# EAGLE schematic untitled (EAGLE 9.6.2)
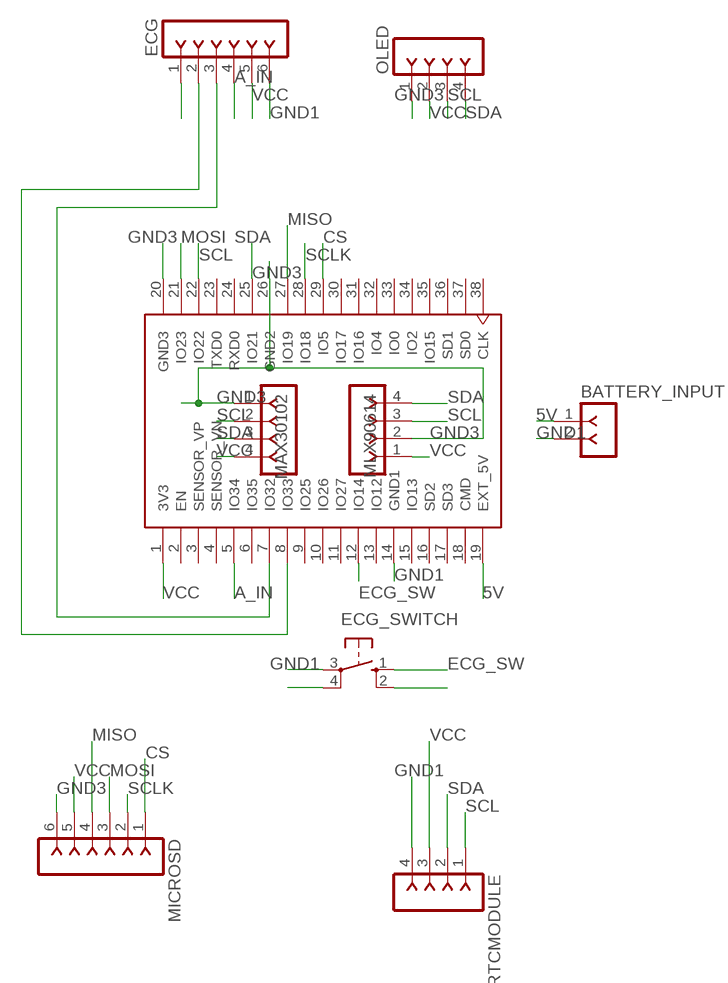
[diagram p0: schematic, sheet 1]

## Parts
BATTERY_INPUT  F-1X02-SIP-100-40  [SIP-100-02-40]
ECG  F-1X06-SIP-100-40  [SIP-100-06-40]
ECG_SWITCH  10-XX  [B3F-10XX]
MAX30102  F-1X04-SIP-100-40  [SIP-100-04-40]
MICROSD  F-1X06-SIP-100-40  [SIP-100-06-40]
MLX90614  F-1X04-SIP-100-40  [SIP-100-04-40]
OLED  F-1X04-SIP-100-40  [SIP-100-04-40]
RTCMODULE  F-1X04-SIP-100-40  [SIP-100-04-40]
U1  ESP32-DEVKITC-32D  [MODULE_ESP32-DEVKITC-32D]

## Nets
5V: BATTERY_INPUT.1 U1.19(EXT_5V)
A_IN: ECG.4 U1.5(IO34)
CS: MICROSD.1 U1.29(IO5)
ECG_SW: ECG_SWITCH.1(S) U1.12(IO14)
GND1: BATTERY_INPUT.2 ECG.6 ECG_SWITCH.3(P) RTCMODULE.4 U1.14(GND1)
GND3: MAX30102.1 MICROSD.6 MLX90614.2 OLED.1 U1.20(GND3) U1.26(GND2)
MISO: MICROSD.4 U1.27(IO19)
MOSI: MICROSD.3 U1.21(IO23)
N$2: ECG_SWITCH.4(P1)
N$4: ECG_SWITCH.2(S1)
N$7: ECG.1
N$8: ECG.2 U1.8(IO33)
N$9: ECG.3 U1.7(IO32)
SCL: MAX30102.2 MLX90614.3 OLED.3 RTCMODULE.1 U1.22(IO22)
SCLK: MICROSD.2 U1.28(IO18)
SDA: MAX30102.3 MLX90614.4 OLED.4 RTCMODULE.2 U1.25(IO21)
VCC: ECG.5 MAX30102.4 MICROSD.5 MLX90614.1 OLED.2 RTCMODULE.3 U1.1(3V3)
Unconnected: U1.2(EN) U1.3(SENSOR_VP) U1.4(SENSOR_VN) U1.6(IO35) U1.9(IO25) U1.10(IO26) U1.11(IO27) U1.13(IO12) U1.15(IO13) U1.16(SD2) U1.17(SD3) U1.18(CMD) U1.23(TXD0) U1.24(RXD0) U1.30(IO17) U1.31(IO16) U1.32(IO4) U1.33(IO0) U1.34(IO2) U1.35(IO15) U1.36(SD1) U1.37(SD0) U1.38(CLK)

## Library data of the parts
BATTERY_INPUT = con-headers-jp:F-1X02-: FEMALE HEADER
ECG MICROSD = con-headers-jp:F-1X06-: FEMALE HEADER
ECG_SWITCH = switch-omron:10-XX: OMRON SWITCH; MPN: B3F-1000; OC_FARNELL: 176432; OC_NEWARK: 36M3542
MAX30102 MLX90614 OLED RTCMODULE = con-headers-jp:F-1X04-: FEMALE HEADER
U1 = KLEIN:ESP32-DEVKITC-32D: Eval Board For Esp-Wroom-32 Check prices <https://pricing.snapeda.com/parts/ESP32-DEVKITC-32D/Espressif%20Systems/view-part?ref=eda>; AVAILABILITY: Warning; DESCRIPTION: WiFi Development Tools (802.11) ESP32 General Development Kit, ESP32-WROOM-32D on the board; MF: Espressif Systems; MP: ESP32-DEVKITC-32D; PACKAGE: None; PRICE: None; PURCHASE-URL: https://pricing.snapeda.com/search/part/ESP32-DEVKITC-32D/?ref=eda

## Net classes
0 default: width 0.4 mm, clearance 0.2 mm